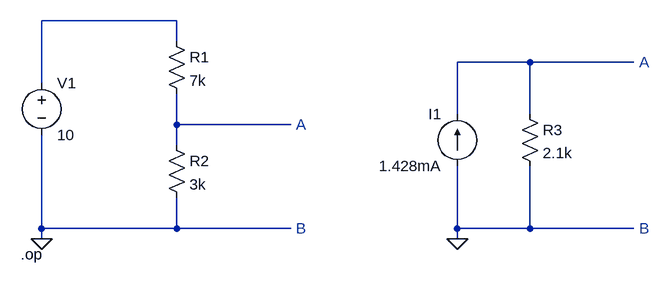
[diagram p0: schematic circuit.asc]
circuit.asc, the LTspice schematic file:
Version 4.1
SHEET 1 992 680
WIRE 240 16 32 16
WIRE 240 48 240 16
WIRE 784 80 672 80
WIRE 944 80 784 80
WIRE 32 112 32 16
WIRE 672 160 672 80
WIRE 784 160 784 80
WIRE 240 176 240 128
WIRE 416 176 240 176
WIRE 240 208 240 176
WIRE 32 336 32 192
WIRE 240 336 240 288
WIRE 240 336 32 336
WIRE 416 336 240 336
WIRE 672 336 672 240
WIRE 784 336 784 240
WIRE 784 336 672 336
WIRE 944 336 784 336
WIRE 32 352 32 336
WIRE 672 352 672 336
FLAG 32 352 0
FLAG 672 352 0
DATAFLAG 240 176 ""
DATAFLAG 240 16 ""
DATAFLAG 240 336 ""
DATAFLAG 928 80 ""
SYMBOL voltage 32 96 R0
WINDOW 123 0 0 Left 0
WINDOW 39 0 0 Left 0
SYMATTR InstName V1
SYMATTR Value 10
SYMBOL res 224 32 R0
SYMATTR InstName R1
SYMATTR Value 7k
SYMBOL res 224 192 R0
SYMATTR InstName R2
SYMATTR Value 3k
SYMBOL current 672 240 R180
WINDOW 0 24 80 Left 2
WINDOW 3 24 0 Left 2
WINDOW 123 0 0 Left 0
WINDOW 39 0 0 Left 0
SYMATTR InstName I1
SYMATTR Value 1.428mA
SYMBOL res 768 144 R0
SYMATTR InstName R3
SYMATTR Value 2.1k
TEXT 0 376 Left 2 !.op
TEXT 424 176 Left 2 ;A
TEXT 424 336 Left 2 ;B
TEXT 952 80 Left 2 ;A
TEXT 952 336 Left 2 ;B

The netlist it stands for:
* circuit.asc
V1 N001 0 10
R1 N001 N003 7k
R2 N003 0 3k
I1 0 N002 1.428mA
R3 N002 0 2.1k
.op
* A
* B
* A
* B
.backanno
.end